# EasyEDA schematic SoundSystem V0.0.1.json
TITLE: SoundSystem; REV: 1.0; Date: 2026-05-22; Sheet: 1/1; Company: Zakary CHAUVE
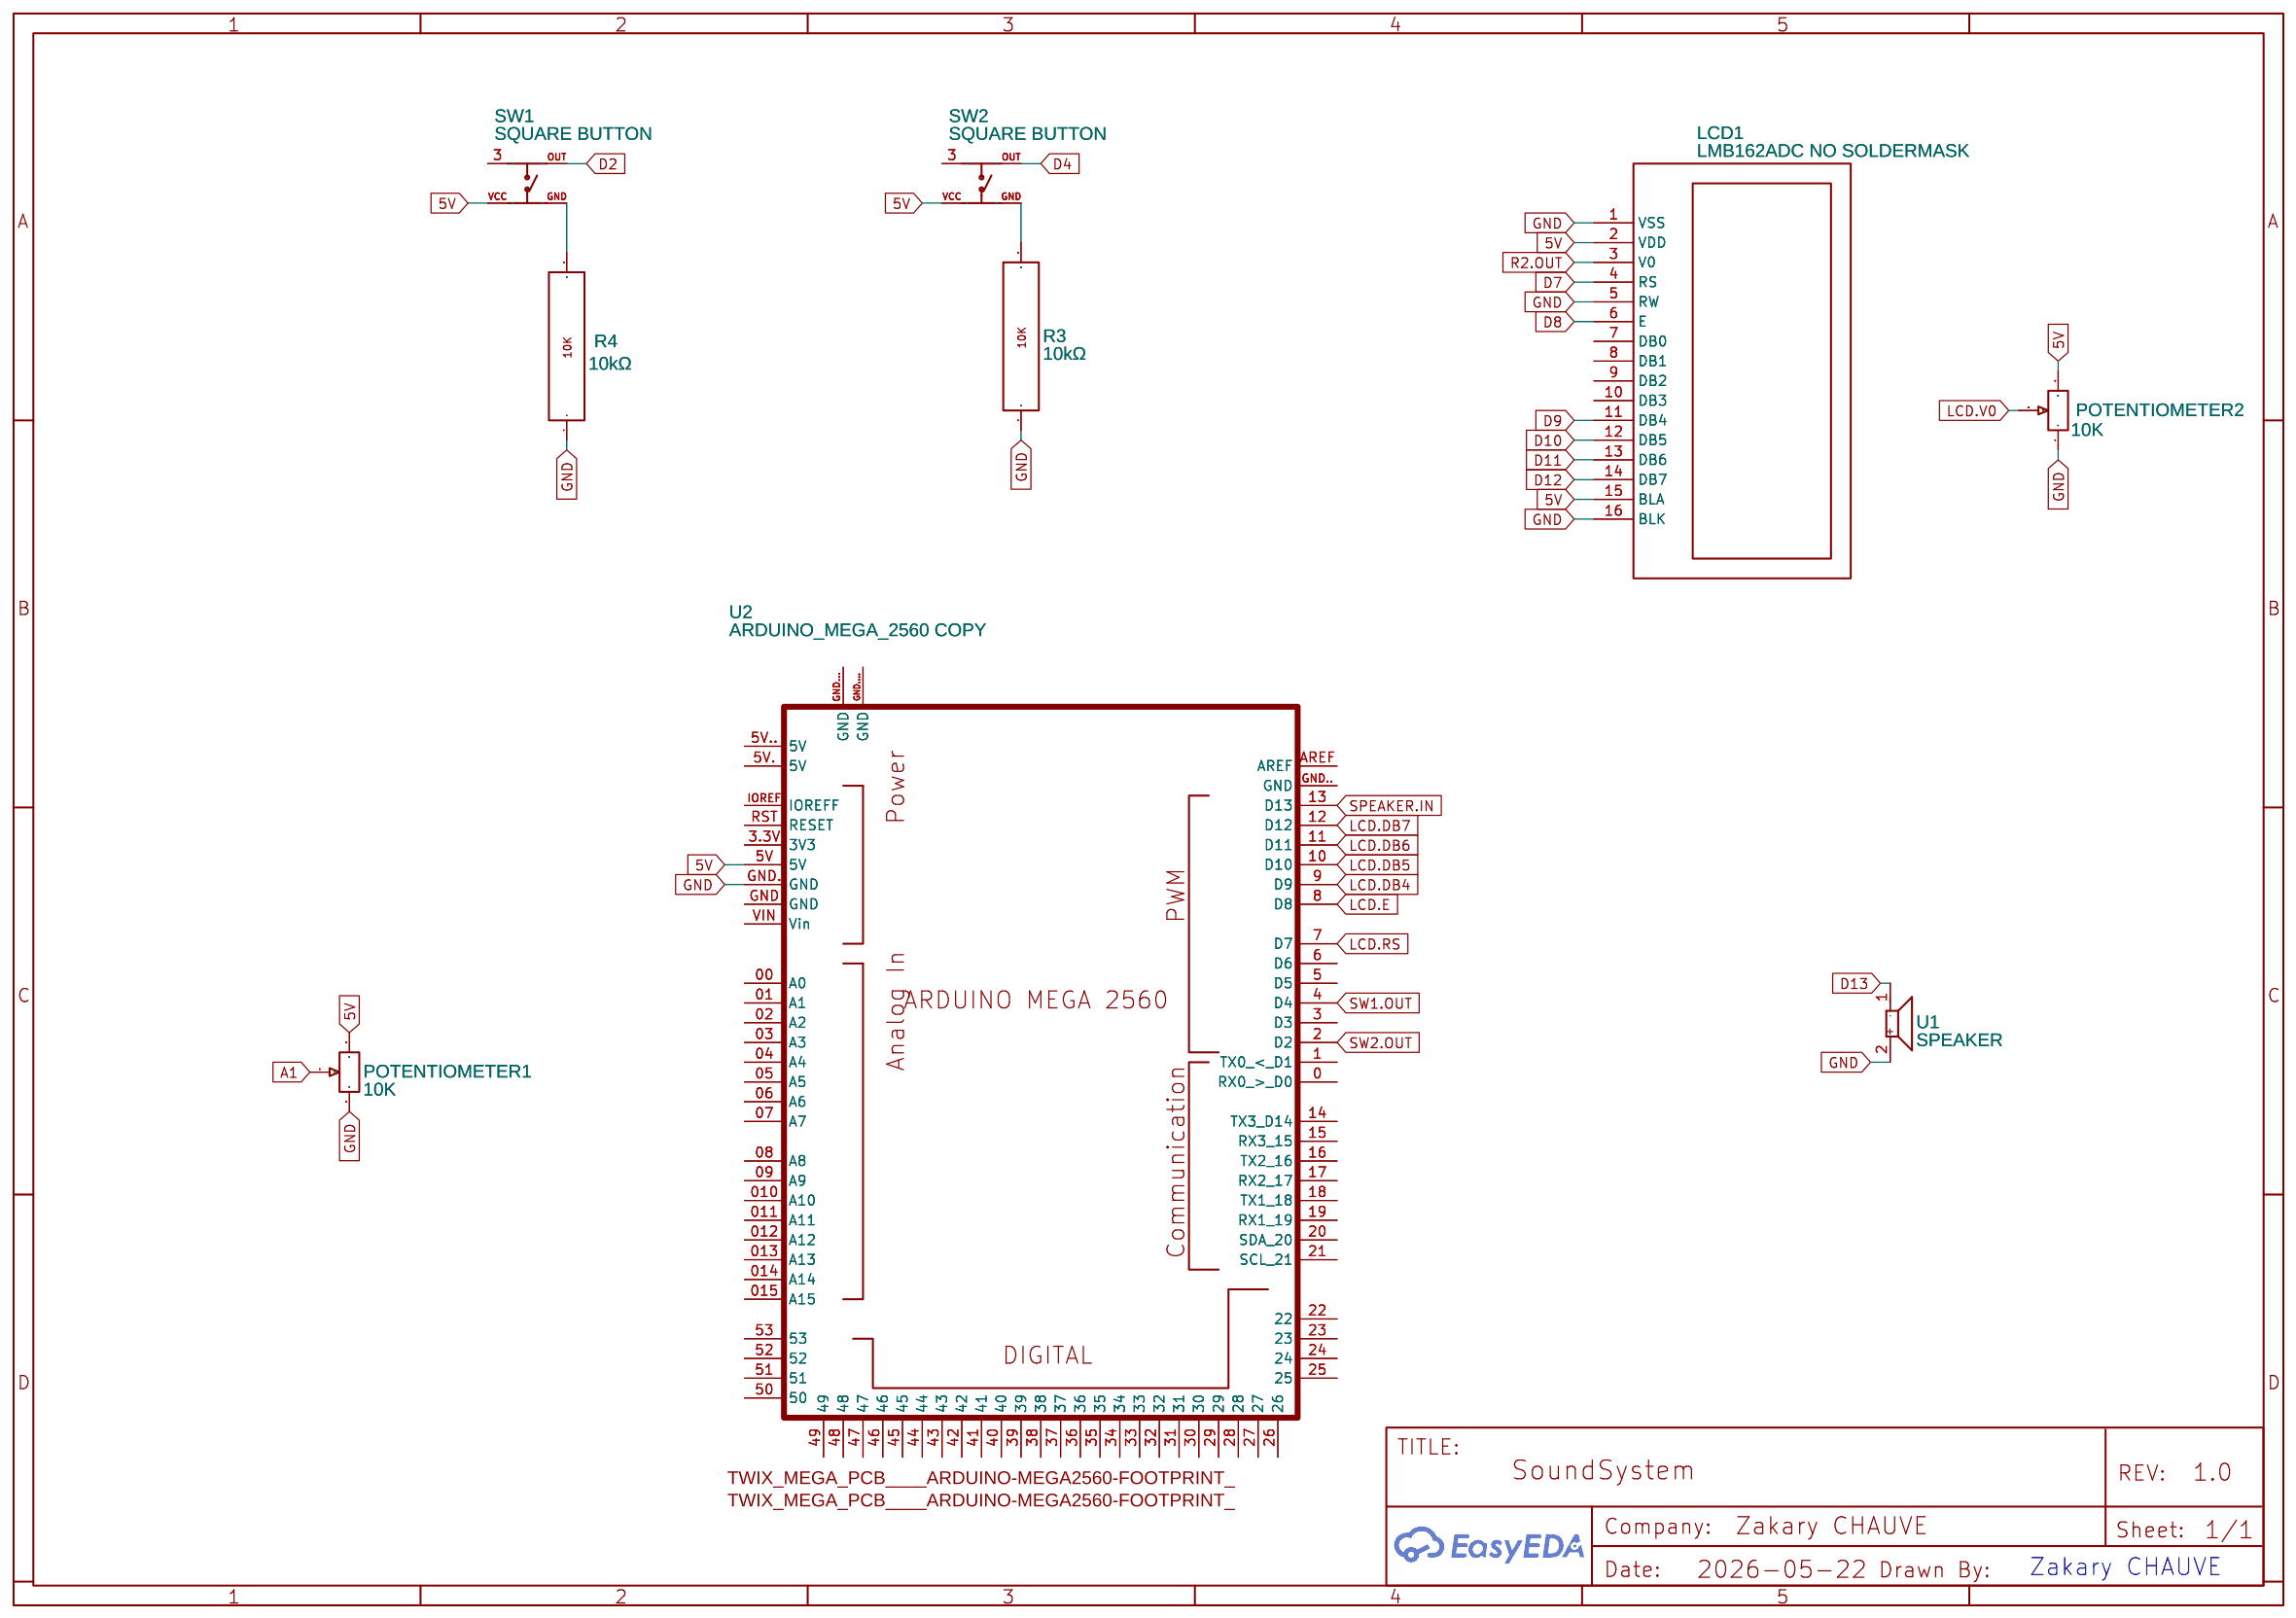
[diagram p0: schematic sheet]

## Parts
LCD1  LMB162ADC NO SOLDERMASK  [LCD1602]
POTENTIOMETER1  10K  [POT-10K-POTENTIOMETER]
POTENTIOMETER2  10K  [POT-10K-POTENTIOMETER]
R3  10kΩ  [FOOTPRINT--XX--RESISTOR-1/4W-10K-1-PERCENT]
R4  10kΩ  [FOOTPRINT--XX--RESISTOR-1/4W-10K-1-PERCENT]
SW1  SQUARE BUTTON  [SW-SMD_4P-L6.0-W6.0-P4.50-LS9.0-H7.3]
SW2  SQUARE BUTTON  [SW-SMD_4P-L6.0-W6.0-P4.50-LS9.0-H7.3]
U1  SPEAKER  [SPEAKER]
U2  ARDUINO_MEGA_2560 COPY  [TWIX_MEGA_PCB____ARDUINO-MEGA2560-FOOTPRINT_]

## Library data of the parts
LCD1 = LMB162ADC NO SOLDERMASK: Supplier: LCSC; Manufacturer: TOPWAY; Manufacturer Part: LMB162ADC; Supplier Part: C9741
POTENTIOMETER1 POTENTIOMETER2 = Pot-10k-Potentiometer: Supplier: LCSC; Manufacturer: JML; Manufacturer Part: Potentiometer WH160-1-104; Supplier Part: C61836; Contributor: RafiqueUddinMazumder
R3 R4 = RESISTOR-1/4W-10K-1-PERCENT C: Supplier: LCSC; Supplier Part: C119347; Manufacturer: CCO(千志电子); Manufacturer Part: MF1/4W-10KΩ±1% T; Resistance (Ohms): 10K; Contributor: LCSC; JLCPCB Part Class: Extended Part
SW1 SW2 = HX-6X6X7.3-TP FT SQUARE BUTTON: Supplier: LCSC; Supplier Part: C49234152; Manufacturer: hanxia(韩下); Manufacturer Part: HX-6x6x7.3-TP FT square button; JLCPCB Part Class: Extended Part; Contributor: lcsc
U1 = speaker: Contributor: daphnequinonesladroma
U2 = ARDUINO_MEGA_2560 COPY: Contributor: kenwayofali; Package Display: Yes

## Nets
5V: LCD1.2(VDD) LCD1.15(BLA) POTENTIOMETER1.3 POTENTIOMETER2.3 SW1.VCC(A) SW2.VCC(A) U2.5V
GND: LCD1.1(VSS) LCD1.5(RW) LCD1.16(BLK) POTENTIOMETER1.1 POTENTIOMETER2.1 R3.1 R4.1 U1.2(+) U2.GND.(GND)
A1: POTENTIOMETER1.2
D2: SW1.OUT(D)
D4: SW2.OUT(D)
D7: LCD1.4(RS)
D8: LCD1.6(E)
D9: LCD1.11(DB4)
D10: LCD1.12(DB5)
D11: LCD1.13(DB6)
D12: LCD1.14(DB7)
D13: U1.1(-)
LCD.DB4: U2.9(D9)
LCD.DB5: U2.10(D10)
LCD.DB6: U2.11(D11)
LCD.DB7: U2.12(D12)
LCD.E: U2.8(D8)
LCD.RS: U2.7(D7)
LCD.V0: POTENTIOMETER2.2
R2.OUT: LCD1.3(V0)
SPEAKER.IN: U2.13(D13)
SW1.OUT: U2.4(D4)
SW2.OUT: U2.2(D2)
Net-(R3-2): R3.2 SW2.GND(B)
Net-(R4-2): R4.2 SW1.GND(B)

Not connected (* = marked no-connect by the designer): LCD1 7(DB0) 8(DB1) 9(DB2) 10(DB3); SW1 3(C); SW2 3(C); U2 00(A0) 0(RX0 > D0) 01(A1) 1(TX0 < D1) 02(A2) 03(A3) 3(D3) 3.3V(3V3) 04(A4) 05(A5) 5(D5) 5V.(5V) 5V..(5V) 06(A6) 6(D6) 07(A7) 08(A8) 09(A9) 010(A10) 011(A11) 012(A12) 013(A13) 014(A14) 14(TX3 D14) 015(A15) 15(RX3 15) 16(TX2 16) 17(RX2 17) 18(TX1 18) 19(RX1 19) 20(SDA 20) 21(SCL 21) 22 23 24 25 26 27 28 29 30 31 32 33 34 35 36 37 38 39 40 41 42 43 44 45 46 47 48 49 50 51 52 53 AREF GND GND..(GND) GND...(GND) GND....(GND) IOREF(IOREFF) RST(RESET) VIN(Vin)

## Notes on the sheet
- Zakary CHAUVE
